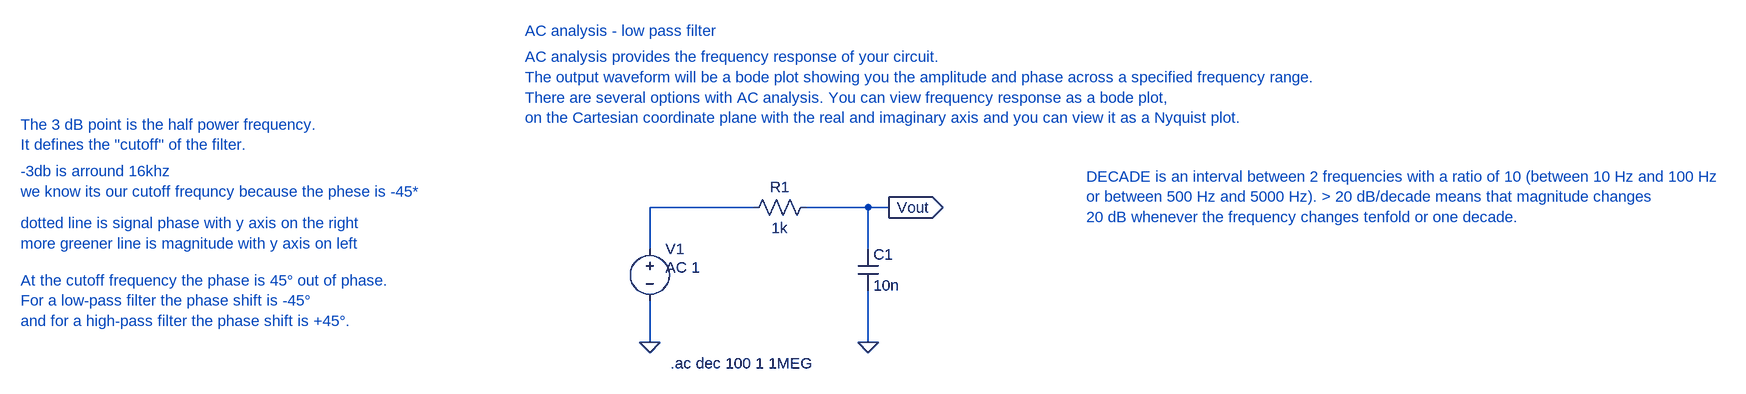
[diagram p0: schematic AC_analysis.asc]
AC_analysis.asc, the LTspice schematic file:
Version 4
SHEET 1 1344 680
WIRE -320 -288 -480 -288
WIRE -144 -288 -240 -288
WIRE -112 -288 -144 -288
WIRE -480 -224 -480 -288
WIRE -144 -224 -144 -288
WIRE -480 -80 -480 -144
WIRE -144 -80 -144 -160
FLAG -480 -80 0
FLAG -144 -80 0
FLAG -112 -288 Vout
IOPIN -112 -288 Out
SYMBOL voltage -480 -240 R0
WINDOW 123 24 44 Left 2
WINDOW 39 0 0 Left 0
SYMATTR InstName V1
SYMATTR Value ""
SYMATTR Value2 AC 1
SYMBOL res -224 -304 R90
WINDOW 0 0 56 VBottom 2
WINDOW 3 32 56 VTop 2
SYMATTR InstName R1
SYMATTR Value 1k
SYMBOL cap -160 -224 R0
SYMATTR InstName C1
SYMATTR Value 10n
TEXT -672 -520 Left 2 ;AC analysis provides the frequency response of your circuit.\nThe output waveform will be a bode plot showing you the amplitude and phase across a specified frequency range.\nThere are several options with AC analysis. You can view frequency response as a bode plot,\non the Cartesian coordinate plane with the real and imaginary axis and you can view it as a Nyquist plot.
TEXT -672 -560 Left 2 ;AC analysis - low pass filter
TEXT -448 -48 Left 2 !.ac dec 100 1 1MEG
TEXT -1448 -416 Left 2 ;The 3 dB point is the half power frequency.\nIt defines the "cutoff" of the filter.
TEXT -1448 -344 Left 2 ;-3db is arround 16khz\nwe know its our cutoff frequncy because the phese is -45*
TEXT -1448 -264 Left 2 ;dotted line is signal phase with y axis on the right\nmore greener line is magnitude with y axis on left
TEXT -1448 -176 Left 2 ;At the cutoff frequency the phase is 45° out of phase.\nFor a low-pass filter the phase shift is -45°\nand for a high-pass filter the phase shift is +45°.
TEXT 192 -336 Left 2 ;DECADE is an interval between 2 frequencies with a ratio of 10 (between 10 Hz and 100 Hz\nor between 500 Hz and 5000 Hz). > 20 dB/decade means that magnitude changes\n20 dB whenever the frequency changes tenfold or one decade.

The netlist it stands for:
* AC_analysis.asc
V1 N001 0 AC 1
R1 Vout N001 1k
C1 Vout 0 10n
* AC analysis provides the frequency response of your circuit.
* The output waveform will be a bode plot showing you the amplitude and phase across a specified frequency range.
* There are several options with AC analysis. You can view frequency response as a bode plot,
* on the Cartesian coordinate plane with the real and imaginary axis and you can view it as a Nyquist plot.
* AC analysis - low pass filter
.ac dec 100 1 1MEG
* The 3 dB point is the half power frequency.
* It defines the "cutoff" of the filter.
* -3db is arround 16khz
* we know its our cutoff frequncy because the phese is -45*
* dotted line is signal phase with y axis on the right
* more greener line is magnitude with y axis on left
* At the cutoff frequency the phase is 45° out of phase.
* For a low-pass filter the phase shift is -45°
* and for a high-pass filter the phase shift is +45°.
* DECADE is an interval between 2 frequencies with a ratio of 10 (between 10 Hz and 100 Hz
* or between 500 Hz and 5000 Hz). > 20 dB/decade means that magnitude changes
* 20 dB whenever the frequency changes tenfold or one decade.
.backanno
.end

* Results of the author's LTspice run, read from the files saved beside the schematic
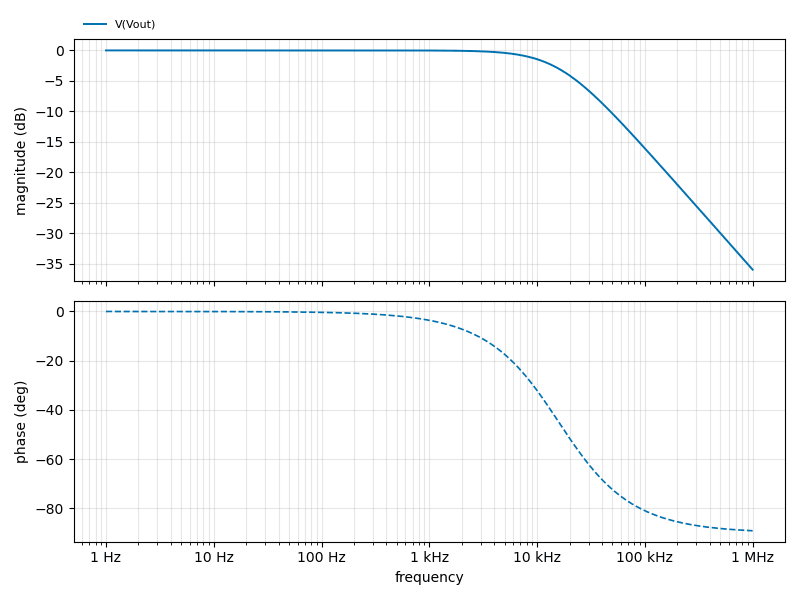
[diagram p1: AC Analysis of AC_analysis.asc, plotted from the saved traces]
* AC Analysis, 1 run:
*   V(Vout): -0.00 dB at 1 Hz, -35.96 dB at 1 MHz, peak -0.00 dB at 1 Hz, 3 dB below the peak at 15.91 kHz